# EAGLE design PitotPboard3 (EAGLE 9.2.2)
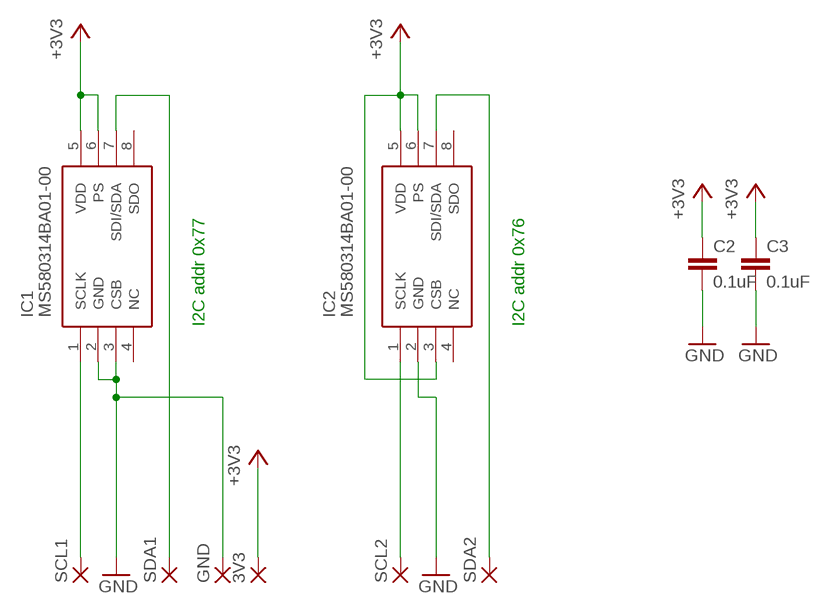
[diagram p0: schematic, sheet 1]

## Parts
3V3  1,6/0,9  [1,6/0,9]
C2  0.1uF  C-EUC0603K  [C0603K]
C3  0.1uF  C-EUC0603K  [C0603K]
GND  1,6/0,9  [1,6/0,9]
IC1  MS580314BA01-00  [MS580314BA0100]
IC2  MS580314BA01-00  [MS580314BA0100]
SCL1  1,6/0,9  [1,6/0,9]
SCL2  1,6/0,9  [1,6/0,9]
SDA1  1,6/0,9  [1,6/0,9]
SDA2  1,6/0,9  [1,6/0,9]

## Nets
+3V3: 3V3.1(P) C2.1 C3.1 IC1.5(VDD) IC1.6(PS) IC2.3(CSB) IC2.5(VDD) IC2.6(PS)
GND: C2.2 C3.2 GND.1(P) IC1.2(GND) IC1.3(CSB) IC2.2(GND)
N$3: IC2.1(SCLK) SCL2.1(P)
N$6: IC2.7(SDI/SDA) SDA2.1(P)
N$7: IC1.7(SDI/SDA) SDA1.1(P)
SCK: IC1.1(SCLK) SCL1.1(P)
Unconnected: IC1.4(NC) IC1.8(SDO) IC2.4(NC) IC2.8(SDO)

## Notes on the sheet
- I2C addr 0x77 | I2C addr 0x76

## Library data of the parts
3V3 GND SCL1 SCL2 SDA1 SDA2 = wirepad:1,6/0,9: THROUGH-HOLE PAD
C2 C3 = rcl:C-EU: CAPACITOR, European symbol; SPICEPREFIX: C
IC1 IC2 = MS580314BA01-00:MS580314BA01-00: Sensor Pressure SMD MS5803-14BA 14bar Source: Datasheet <https://www.te.com/commerce/DocumentDelivery/DDEController?Action=showdoc&DocId=Data SheetMS5803-14BAB3pdfEnglishENG_DS_MS5803-14BA_B3.pdfMS580314BA01-00>; ARROW_PART_NUMBER: MS580314BA01-00; ARROW_PRICE-STOCK: https://www.arrow.com/en/products/ms580314ba01-00/te-connectivity; DESCRIPTION: Sensor Pressure SMD MS5803-14BA 14bar; HEIGHT: 3.03mm; MANUFACTURER_NAME: TE Connectivity; MANUFACTURER_PART_NUMBER: MS580314BA01-00; MOUSER_PART_NUMBER: 824-MS580314BA01-00; MOUSER_PRICE-STOCK: https://www.mouser.co.uk/ProductDetail/Measurement-Specialties/MS580314BA01-00?qs=oFx6pF86PmChyzStAtLLQA%3D%3D

## Board
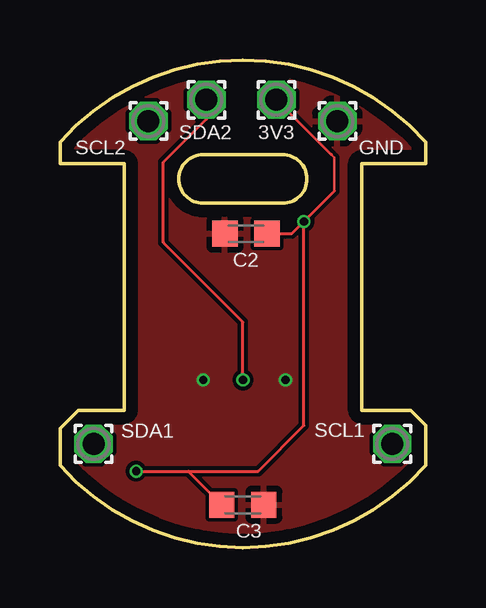
[diagram p1: board, top side]
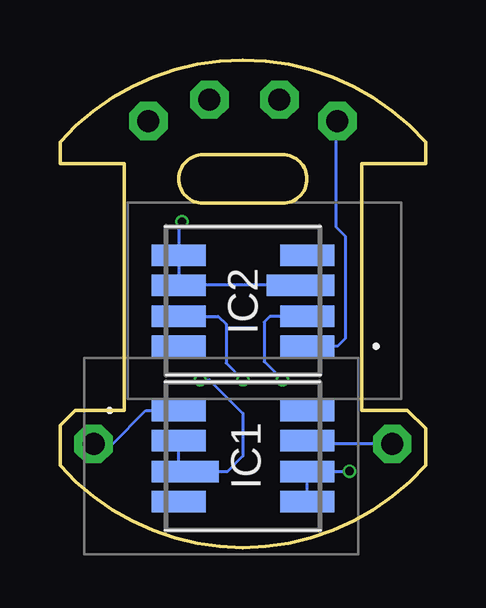
[diagram p2: board, bottom side, seen from below]

Size 15.24 x 20.33 mm. Coordinates in mm from the lower left corner, seen from the top.
Outline: 2.67,5.72 2.67,16.01 0,16.01 0,16.9 arc-97 15.24,16.9 15.24,16.01 12.57,16.01 12.57,5.72 14.61,5.72 15.24,5.09 15.24,3.44 arc-97 0,3.44 0,4.96 0.76,5.72 2.67,5.72
Outline: 5.97,16.39 9.27,16.39 arc-180 9.27,14.36 5.97,14.36 arc-180 5.97,16.39
Copper layers (1*16): Top 0.035mm / dielectric 1.5mm / Bottom 0.035mm
Design rules "default *": minimum track width 4mil, minimum drill 0.35mm, track to track 6mil, track to pad 6mil, pad to pad 6mil, via to via 6mil, smd to smd 6mil, copper to edge 20mil, drill to drill 4mil, minimum pad ring 6mil, minimum via ring 4mil, stop-mask expansion 4mil, vias tented up to drill 0mil, thermal gap 10mil

### Footprints (pad centres in the part's own frame; a part is rotated, then mirrored left to right if it is on the bottom)
1,6/0,9 = drill 0.914 pad 1.6 octagon: 1 0,0
C0603K = smd 1.05 x 1.08: 1 -0.875,0; 2 0.875,0
MS580314BA0100 = smd 2.25 x 0.9: 1 2.675,-1.9; 2 2.675,-0.65; 4 2.675,1.9; 5 -2.675,1.9; 6 -2.675,0.65; 7 -2.675,-0.65; 8 -2.675,-1.9 | smd 2.8 x 0.9: 3 2.4,0.65

### Placement (x,y rotation side)
3V3  9.02,18.68 0 top
C2  7.75,13.09 180 top
C3  7.62,1.79 0 top
GND  11.56,17.79 0 top
IC1  7.62,3.82 180 bottom
IC2  7.62,10.29 0 bottom
SCL1  13.84,4.33 0 top
SCL2  3.68,17.79 0 top
SDA1  1.4,4.33 0 top
SDA2  6.1,18.68 0 top

### Tracks (layer width: path | path; a pad name or v marks a point on that pad's centre or on a via)
+3V3  (via drill 0.35)
  Top 0.102: 11.3,16.39 11.43,16.26 11.43,14.87 | 10.16,9.77 10.16,5.09
  Top 0.127: v10.16,13.6 11.43,14.87 | v10.16,13.6 10.16,5.09 8.26,3.18 5.35,3.18 | 11.3,16.39 3V3.1 | C2.1 9.65,13.09 v10.16,13.6 | C3.1 5.35,3.18 | v3.17,3.18 5.35,3.18
  Bottom 0.127: 10.4,12.19 IC2.5 | IC2.5 IC2.6 IC2.3 | IC1.5 IC1.6 4.93,3.18 v3.17,3.18 | IC2.5 10.29,13.47 v10.16,13.6
GND  (via drill 0.35)
  Bottom 0.127: IC1.2 10.29,3.44 IC1.3 8.27,3.17 7.62,3.82 7.62,5.6 9.02,6.99 v9.4,6.99 | IC2.2 6.49,9.64 6.73,9.41 6.73,7.75 v5.97,6.99
  pour Top: -1.27,1.28 -1.27,17.79 2.54,21.6 12.7,21.6 16.51,17.79 16.51,1.28 13.97,-1.26 1.27,-1.26
N$3
  Bottom 0.102: SCL2.1 3.75,17.72
  Bottom 0.127: IC2.1 3.68,8.39 3.35,8.72 3.35,12.99 3.75,13.38 3.75,17.72
N$6  (via drill 0.35)
  Top 0.127: SDA2.1 6.1,17.86 4.3,16.07 4.3,12.72 7.62,9.41 v7.62,6.99
  Bottom 0.127: IC2.7 8.65,9.64 8.32,9.31 8.32,7.69 v7.62,6.99
N$7
  Bottom 0.127: SDA1.1 4.8,4.33 IC1.7
SCK
  Bottom 0.127: SCL1.1 13.83,4.31 13.07,4.31 11.66,5.72 IC1.1